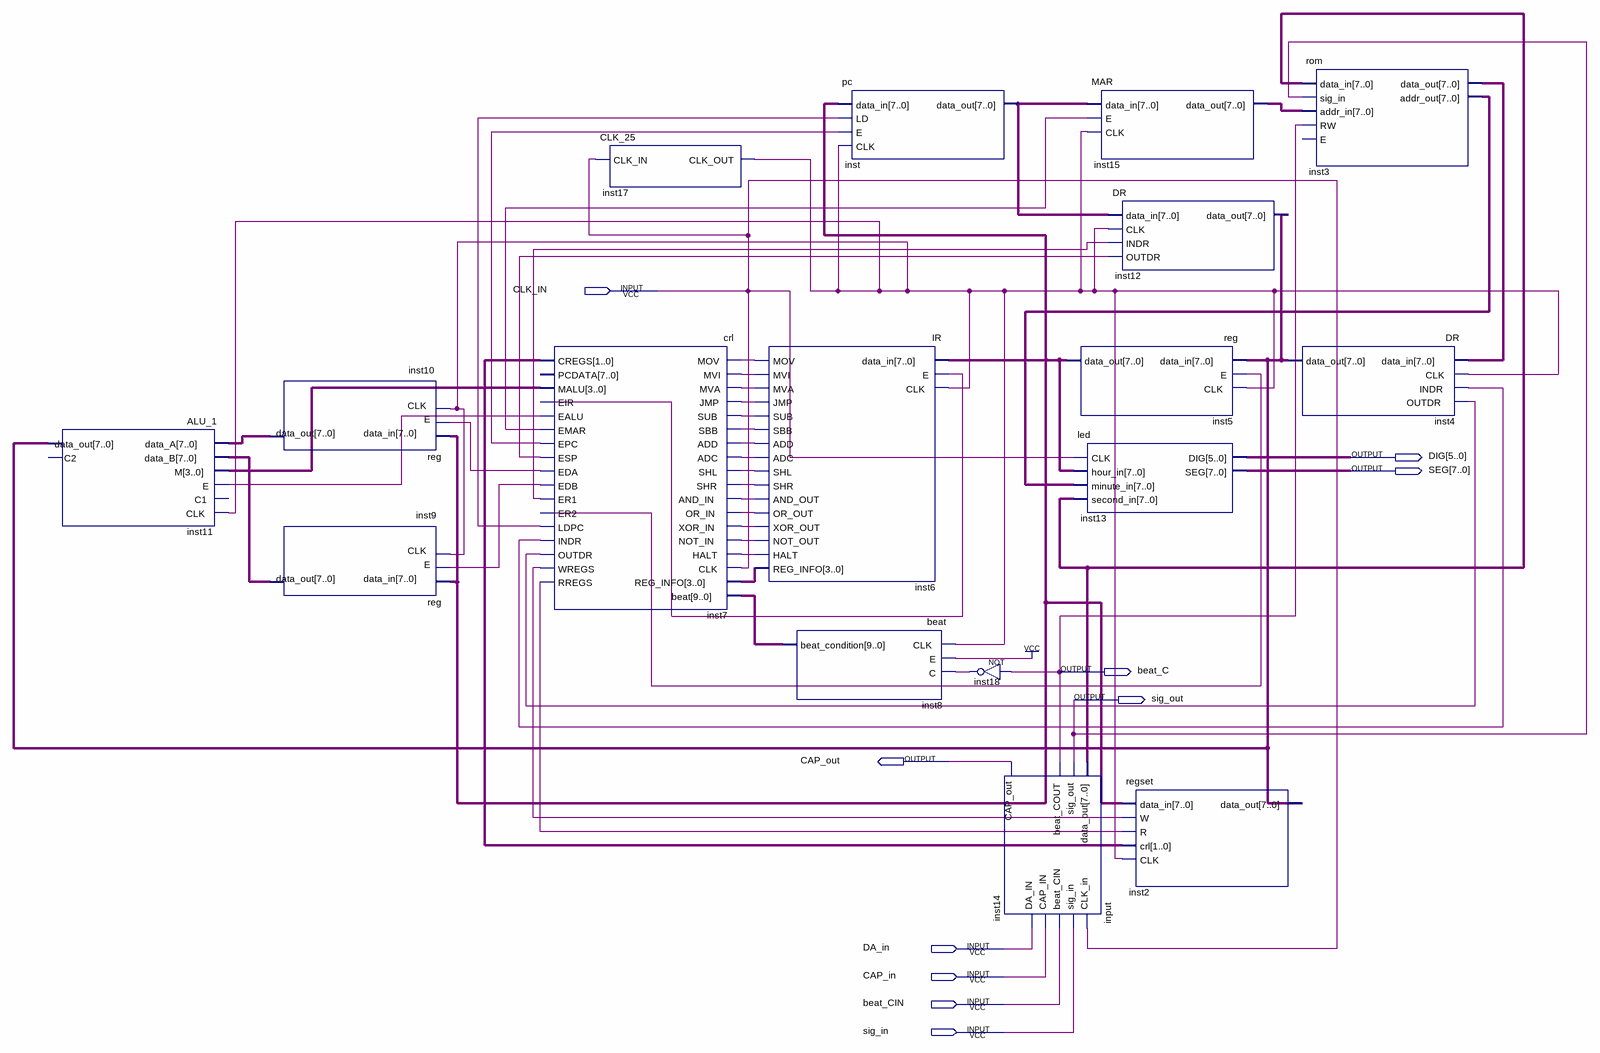
[diagram p0: schematic sheet]
// Quartus schematic cpu_8bit.bdf as structural Verilog: 17 symbols, 10 pins
module cpu_8bit (
  input  CLK_IN,
  input  DA_in,
  input  CAP_in,
  input  beat_CIN,
  input  sig_in,
  output [5:0] DIG,
  output [7:0] SEG,
  output beat_C,
  output sig_out,
  output CAP_out
);

  wire inst6_adc, inst6_add, inst6_and_out, inst6_halt, inst6_jmp, inst6_mov, inst6_mva, inst6_mvi,
       inst6_not_out, inst6_or_out, inst6_sbb, inst6_shl, inst6_shr, inst6_sub, inst6_xor_out, inst7_ealu,
       inst7_eda, inst7_edb, inst7_eir, inst7_emar, inst7_epc, inst7_er1, inst7_er2, inst7_esp, inst7_indr,
       inst7_ldpc, inst7_outdr, inst7_rregs, inst7_wregs, inst17_clk_out, inst18_out;
  wire [1:0] inst7_cregs;
  wire [3:0] inst6_reg_info, inst7_malu;
  wire [7:0] inst3_addr_out, inst3_data_out, inst5_data_out, inst9_data_out, inst10_data_out,
       inst11_data_out, inst14_data_out, inst15_data_out, inst_data_out;
  wire [9:0] inst8_beat_condition;

  ALU_1 inst11 (
    .data_A(inst10_data_out), .data_B(inst9_data_out), .M(inst7_malu), .E(inst7_ealu), .CLK(inst17_clk_out),
    .data_out(inst11_data_out));  // open: C1, C2
  \reg  inst10 (.data_in(inst5_data_out), .E(inst7_eda), .CLK(inst17_clk_out), .data_out(inst10_data_out));
  \reg  inst9 (.data_in(inst5_data_out), .E(inst7_edb), .CLK(inst17_clk_out), .data_out(inst9_data_out));
  crl inst7 (
    .MOV(inst6_mov), .MVI(inst6_mvi), .MVA(inst6_mva), .JMP(inst6_jmp), .SUB(inst6_sub), .SBB(inst6_sbb),
    .ADD(inst6_add), .ADC(inst6_adc), .SHL(inst6_shl), .SHR(inst6_shr), .AND_IN(inst6_and_out),
    .OR_IN(inst6_or_out), .XOR_IN(inst6_xor_out), .NOT_IN(inst6_not_out), .HALT(inst6_halt), .CLK(CLK_IN),
    .REG_INFO(inst6_reg_info), .beat(inst8_beat_condition), .CREGS(inst7_cregs), .MALU(inst7_malu),
    .EIR(inst7_eir), .EALU(inst7_ealu), .EMAR(inst7_emar), .EPC(inst7_epc), .ESP(inst7_esp), .EDA(inst7_eda),
    .EDB(inst7_edb), .ER1(inst7_er1), .ER2(inst7_er2), .LDPC(inst7_ldpc), .INDR(inst7_indr),
    .OUTDR(inst7_outdr), .WREGS(inst7_wregs), .RREGS(inst7_rregs));  // open: PCDATA
  CLK_25 inst17 (.CLK_IN(CLK_IN), .CLK_OUT(inst17_clk_out));
  IR inst6 (
    .data_in(inst5_data_out), .E(inst7_eir), .CLK(inst17_clk_out), .MOV(inst6_mov), .MVI(inst6_mvi),
    .MVA(inst6_mva), .JMP(inst6_jmp), .SUB(inst6_sub), .SBB(inst6_sbb), .ADD(inst6_add), .ADC(inst6_adc),
    .SHL(inst6_shl), .SHR(inst6_shr), .AND_OUT(inst6_and_out), .OR_OUT(inst6_or_out),
    .XOR_OUT(inst6_xor_out), .NOT_OUT(inst6_not_out), .HALT(inst6_halt), .REG_INFO(inst6_reg_info));
  beat inst8 (.CLK(inst17_clk_out), .E(1'b1), .C(inst18_out), .beat_condition(inst8_beat_condition));
  pc inst (.data_in(inst5_data_out), .LD(inst7_ldpc), .E(inst7_epc), .CLK(inst17_clk_out), .data_out(inst_data_out));
  not inst18 (inst18_out, beat_C);
  \input  inst14 (
    .CLK_in(CLK_IN), .sig_in(sig_in), .beat_CIN(beat_CIN), .CAP_IN(CAP_in), .DA_IN(DA_in),
    .data_out(inst14_data_out), .sig_out(sig_out), .beat_COUT(beat_C), .CAP_out(CAP_out));
  MAR inst15 (.data_in(inst_data_out), .E(inst7_emar), .CLK(inst17_clk_out), .data_out(inst15_data_out));
  DR inst12 (
    .data_in(inst_data_out), .CLK(inst17_clk_out), .INDR(inst7_er1), .OUTDR(inst7_esp),
    .data_out(inst11_data_out));
  \reg  inst5 (.data_in(inst11_data_out), .E(inst7_er2), .CLK(inst17_clk_out), .data_out(inst5_data_out));
  led inst13 (
    .CLK(CLK_IN), .hour_in(inst5_data_out), .minute_in(inst3_addr_out), .second_in(inst14_data_out),
    .DIG(DIG), .SEG(SEG));
  regset inst2 (
    .data_in(inst5_data_out), .W(inst7_wregs), .R(inst7_rregs), .crl(inst7_cregs), .CLK(inst17_clk_out),
    .data_out(inst11_data_out));
  rom inst3 (
    .data_in(inst14_data_out), .sig_in(sig_out), .addr_in(inst15_data_out), .RW(beat_C),
    .data_out(inst3_data_out), .addr_out(inst3_addr_out));  // open: E
  DR inst4 (
    .data_in(inst3_data_out), .CLK(inst17_clk_out), .INDR(inst7_indr), .OUTDR(inst7_outdr),
    .data_out(inst11_data_out));
endmodule
